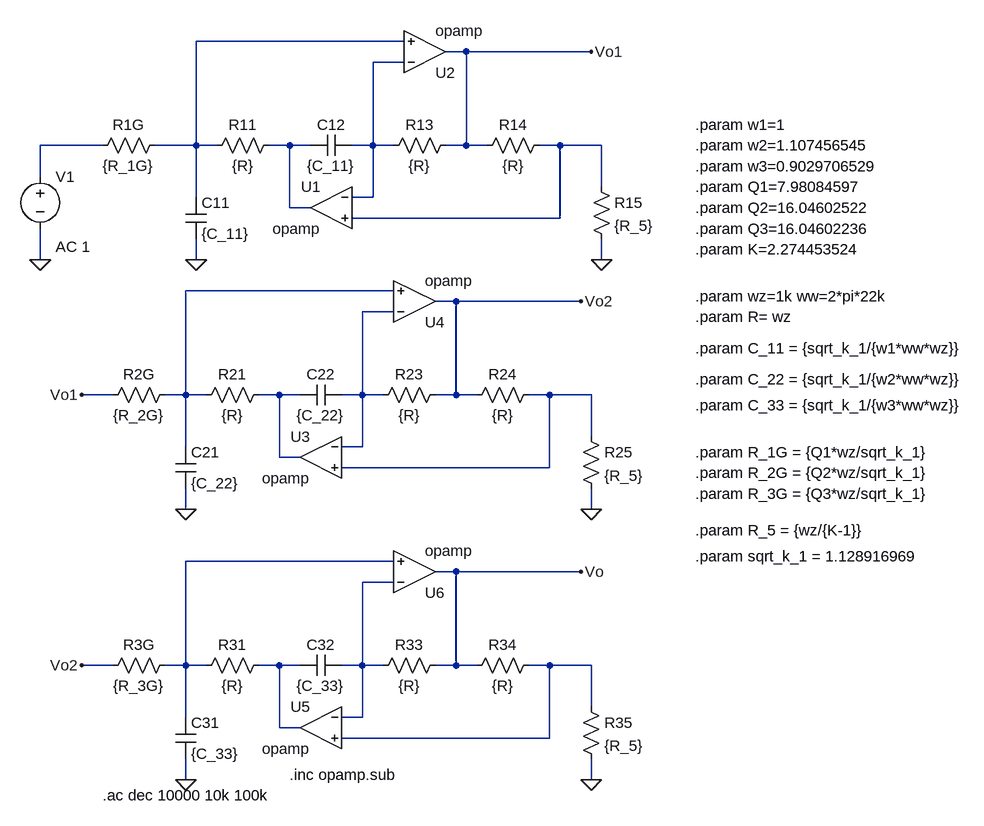
[diagram p0: schematic Circutio_param_V2.asc]
Circutio_param_V2.asc, the LTspice schematic file:
Version 4
SHEET 1 1584 1128
WIRE 432 -48 112 -48
WIRE 528 -32 496 -32
WIRE 720 -32 528 -32
WIRE 432 -16 384 -16
WIRE -32 112 -128 112
WIRE 112 112 112 -48
WIRE 112 112 48 112
WIRE 144 112 112 112
WIRE 256 112 224 112
WIRE 288 112 256 112
WIRE 384 112 384 -16
WIRE 384 112 352 112
WIRE 416 112 384 112
WIRE 528 112 528 -32
WIRE 528 112 496 112
WIRE 560 112 528 112
WIRE 672 112 640 112
WIRE 736 112 672 112
WIRE -128 160 -128 112
WIRE 736 176 736 112
WIRE 112 192 112 112
WIRE 384 192 384 112
WIRE 384 192 352 192
WIRE 256 208 256 112
WIRE 288 208 256 208
WIRE 672 224 672 112
WIRE 672 224 352 224
WIRE -128 288 -128 240
WIRE 112 288 112 256
WIRE 736 288 736 256
WIRE 416 336 96 336
WIRE 512 352 480 352
WIRE 704 352 512 352
WIRE 416 368 368 368
WIRE -16 496 -64 496
WIRE 96 496 96 336
WIRE 96 496 64 496
WIRE 128 496 96 496
WIRE 240 496 208 496
WIRE 272 496 240 496
WIRE 368 496 368 368
WIRE 368 496 336 496
WIRE 400 496 368 496
WIRE 512 496 512 352
WIRE 512 496 480 496
WIRE 544 496 512 496
WIRE 656 496 624 496
WIRE 720 496 656 496
WIRE 720 560 720 496
WIRE 96 576 96 496
WIRE 368 576 368 496
WIRE 368 576 336 576
WIRE 240 592 240 496
WIRE 272 592 240 592
WIRE 656 608 656 496
WIRE 656 608 336 608
WIRE 96 672 96 640
WIRE 720 672 720 640
WIRE 416 752 96 752
WIRE 512 768 480 768
WIRE 704 768 512 768
WIRE 416 784 368 784
WIRE -16 912 -64 912
WIRE 96 912 96 752
WIRE 96 912 64 912
WIRE 128 912 96 912
WIRE 240 912 208 912
WIRE 272 912 240 912
WIRE 368 912 368 784
WIRE 368 912 336 912
WIRE 400 912 368 912
WIRE 512 912 512 768
WIRE 512 912 480 912
WIRE 544 912 512 912
WIRE 656 912 624 912
WIRE 720 912 656 912
WIRE 720 976 720 912
WIRE 96 992 96 912
WIRE 368 992 368 912
WIRE 368 992 336 992
WIRE 240 1008 240 912
WIRE 272 1008 240 1008
WIRE 656 1024 656 912
WIRE 656 1024 336 1024
WIRE 96 1088 96 1056
WIRE 720 1088 720 1056
FLAG 112 288 0
FLAG 736 288 0
FLAG 720 -32 Vo1
FLAG 96 672 0
FLAG 720 672 0
FLAG -64 496 Vo1
FLAG 96 1088 0
FLAG 720 1088 0
FLAG 704 352 Vo2
FLAG -64 912 Vo2
FLAG 704 768 Vo
FLAG -128 288 0
SYMBOL cap 96 192 R0
SYMATTR InstName C11
SYMATTR Value {C_11}
SYMBOL res 240 96 R90
WINDOW 0 0 56 VBottom 2
WINDOW 3 32 56 VTop 2
SYMATTR InstName R11
SYMATTR Value {R}
SYMBOL OpAmps\\opamp 320 144 M0
SYMATTR InstName U1
SYMBOL cap 352 96 R90
WINDOW 0 0 32 VBottom 2
WINDOW 3 32 32 VTop 2
SYMATTR InstName C12
SYMATTR Value {C_11}
SYMBOL res 512 96 R90
WINDOW 0 0 56 VBottom 2
WINDOW 3 32 56 VTop 2
SYMATTR InstName R13
SYMATTR Value {R}
SYMBOL res 656 96 R90
WINDOW 0 0 56 VBottom 2
WINDOW 3 32 56 VTop 2
SYMATTR InstName R14
SYMATTR Value {R}
SYMBOL res 720 160 R0
SYMATTR InstName R15
SYMATTR Value {R_5}
SYMBOL OpAmps\\opamp 464 32 M180
SYMATTR InstName U2
SYMBOL cap 80 576 R0
SYMATTR InstName C21
SYMATTR Value {C_22}
SYMBOL res 224 480 R90
WINDOW 0 0 56 VBottom 2
WINDOW 3 32 56 VTop 2
SYMATTR InstName R21
SYMATTR Value {R}
SYMBOL OpAmps\\opamp 304 528 M0
SYMATTR InstName U3
SYMBOL cap 336 480 R90
WINDOW 0 0 32 VBottom 2
WINDOW 3 32 32 VTop 2
SYMATTR InstName C22
SYMATTR Value {C_22}
SYMBOL res 496 480 R90
WINDOW 0 0 56 VBottom 2
WINDOW 3 32 56 VTop 2
SYMATTR InstName R23
SYMATTR Value {R}
SYMBOL res 640 480 R90
WINDOW 0 0 56 VBottom 2
WINDOW 3 32 56 VTop 2
SYMATTR InstName R24
SYMATTR Value {R}
SYMBOL res 704 544 R0
SYMATTR InstName R25
SYMATTR Value {R_5}
SYMBOL OpAmps\\opamp 448 416 M180
SYMATTR InstName U4
SYMBOL cap 80 992 R0
SYMATTR InstName C31
SYMATTR Value {C_33}
SYMBOL res 224 896 R90
WINDOW 0 0 56 VBottom 2
WINDOW 3 32 56 VTop 2
SYMATTR InstName R31
SYMATTR Value {R}
SYMBOL OpAmps\\opamp 304 944 M0
SYMATTR InstName U5
SYMBOL cap 336 896 R90
WINDOW 0 0 32 VBottom 2
WINDOW 3 32 32 VTop 2
SYMATTR InstName C32
SYMATTR Value {C_33}
SYMBOL res 496 896 R90
WINDOW 0 0 56 VBottom 2
WINDOW 3 32 56 VTop 2
SYMATTR InstName R33
SYMATTR Value {R}
SYMBOL res 640 896 R90
WINDOW 0 0 56 VBottom 2
WINDOW 3 32 56 VTop 2
SYMATTR InstName R34
SYMATTR Value {R}
SYMBOL res 704 960 R0
SYMATTR InstName R35
SYMATTR Value {R_5}
SYMBOL OpAmps\\opamp 448 832 M180
SYMATTR InstName U6
SYMBOL voltage -128 144 R0
WINDOW 123 24 124 Left 2
WINDOW 39 0 0 Left 0
SYMATTR Value2 AC 1
SYMATTR InstName V1
SYMATTR Value ""
SYMBOL res 64 96 R90
WINDOW 0 0 56 VBottom 2
WINDOW 3 32 56 VTop 2
SYMATTR InstName R1G
SYMATTR Value {R_1G}
SYMBOL res 80 480 R90
WINDOW 0 0 56 VBottom 2
WINDOW 3 32 56 VTop 2
SYMATTR InstName R2G
SYMATTR Value {R_2G}
SYMBOL res 80 896 R90
WINDOW 0 0 56 VBottom 2
WINDOW 3 32 56 VTop 2
SYMATTR InstName R3G
SYMATTR Value {R_3G}
TEXT 880 376 Left 2 !.param R= wz
TEXT 880 176 Left 2 !.param Q1=7.98084597
TEXT 880 208 Left 2 !.param Q2=16.04602522
TEXT 880 424 Left 2 !.param C_11 = {sqrt_k_1/{w1*ww*wz}}
TEXT 880 472 Left 2 !.param C_22 = {sqrt_k_1/{w2*ww*wz}}
TEXT 880 512 Left 2 !.param C_33 = {sqrt_k_1/{w3*ww*wz}}
TEXT 880 80 Left 2 !.param w1=1
TEXT 880 112 Left 2 !.param w2=1.107456545
TEXT 880 144 Left 2 !.param w3=0.9029706529
TEXT 880 272 Left 2 !.param K=2.274453524
TEXT 880 704 Left 2 !.param R_5 = {wz/{K-1}}
TEXT 256 1080 Left 2 !.inc opamp.sub
TEXT -32 1112 Left 2 !.ac dec 10000 10k 100k
TEXT 880 744 Left 2 !.param sqrt_k_1 = 1.128916969
TEXT 880 344 Left 2 !.param wz=1k ww=2*pi*22k
TEXT 880 584 Left 2 !.param R_1G = {Q1*wz/sqrt_k_1}
TEXT 880 616 Left 2 !.param R_2G = {Q2*wz/sqrt_k_1}
TEXT 880 648 Left 2 !.param R_3G = {Q3*wz/sqrt_k_1}
TEXT 880 240 Left 2 !.param Q3=16.04602236

The netlist it stands for:
* Circutio_param_V2.asc
C11 N001 0 {C_11}
R11 N004 N001 {R}
XU1 N002 N005 N004 opamp Aol=100K GBW=10Meg  ; pins invin noninvin out
C12 N002 N004 {C_11}
R13 Vo1 N002 {R}
R14 N005 Vo1 {R}
R15 N005 0 {R_5}
XU2 N002 N001 Vo1 opamp Aol=100K GBW=10Meg  ; pins invin noninvin out
C21 N006 0 {C_22}
R21 N008 N006 {R}
XU3 N007 N009 N008 opamp Aol=100K GBW=10Meg  ; pins invin noninvin out
C22 N007 N008 {C_22}
R23 Vo2 N007 {R}
R24 N009 Vo2 {R}
R25 N009 0 {R_5}
XU4 N007 N006 Vo2 opamp Aol=100K GBW=10Meg  ; pins invin noninvin out
C31 N010 0 {C_33}
R31 N012 N010 {R}
XU5 N011 N013 N012 opamp Aol=100K GBW=10Meg  ; pins invin noninvin out
C32 N011 N012 {C_33}
R33 Vo N011 {R}
R34 N013 Vo {R}
R35 N013 0 {R_5}
XU6 N011 N010 Vo opamp Aol=100K GBW=10Meg  ; pins invin noninvin out
V1 N003 0 AC 1
R1G N001 N003 {R_1G}
R2G N006 Vo1 {R_2G}
R3G N010 Vo2 {R_3G}
.param R= wz
.param Q1=7.98084597
.param Q2=16.04602522
.param C_11 = {sqrt_k_1/{w1*ww*wz}}
.param C_22 = {sqrt_k_1/{w2*ww*wz}}
.param C_33 = {sqrt_k_1/{w3*ww*wz}}
.param w1=1
.param w2=1.107456545
.param w3=0.9029706529
.param K=2.274453524
.param R_5 = {wz/{K-1}}
.inc opamp.sub
.ac dec 10000 10k 100k
.param sqrt_k_1 = 1.128916969
.param wz=1k ww=2*pi*22k
.param R_1G = {Q1*wz/sqrt_k_1}
.param R_2G = {Q2*wz/sqrt_k_1}
.param R_3G = {Q3*wz/sqrt_k_1}
.param Q3=16.04602236
.backanno
.end